# Altium schematic sheet MCU_System.SchDoc: MCU Power & Clocks
size A4; DocumentNumber: 4; SheetNumber: 4; SheetTotal: 8
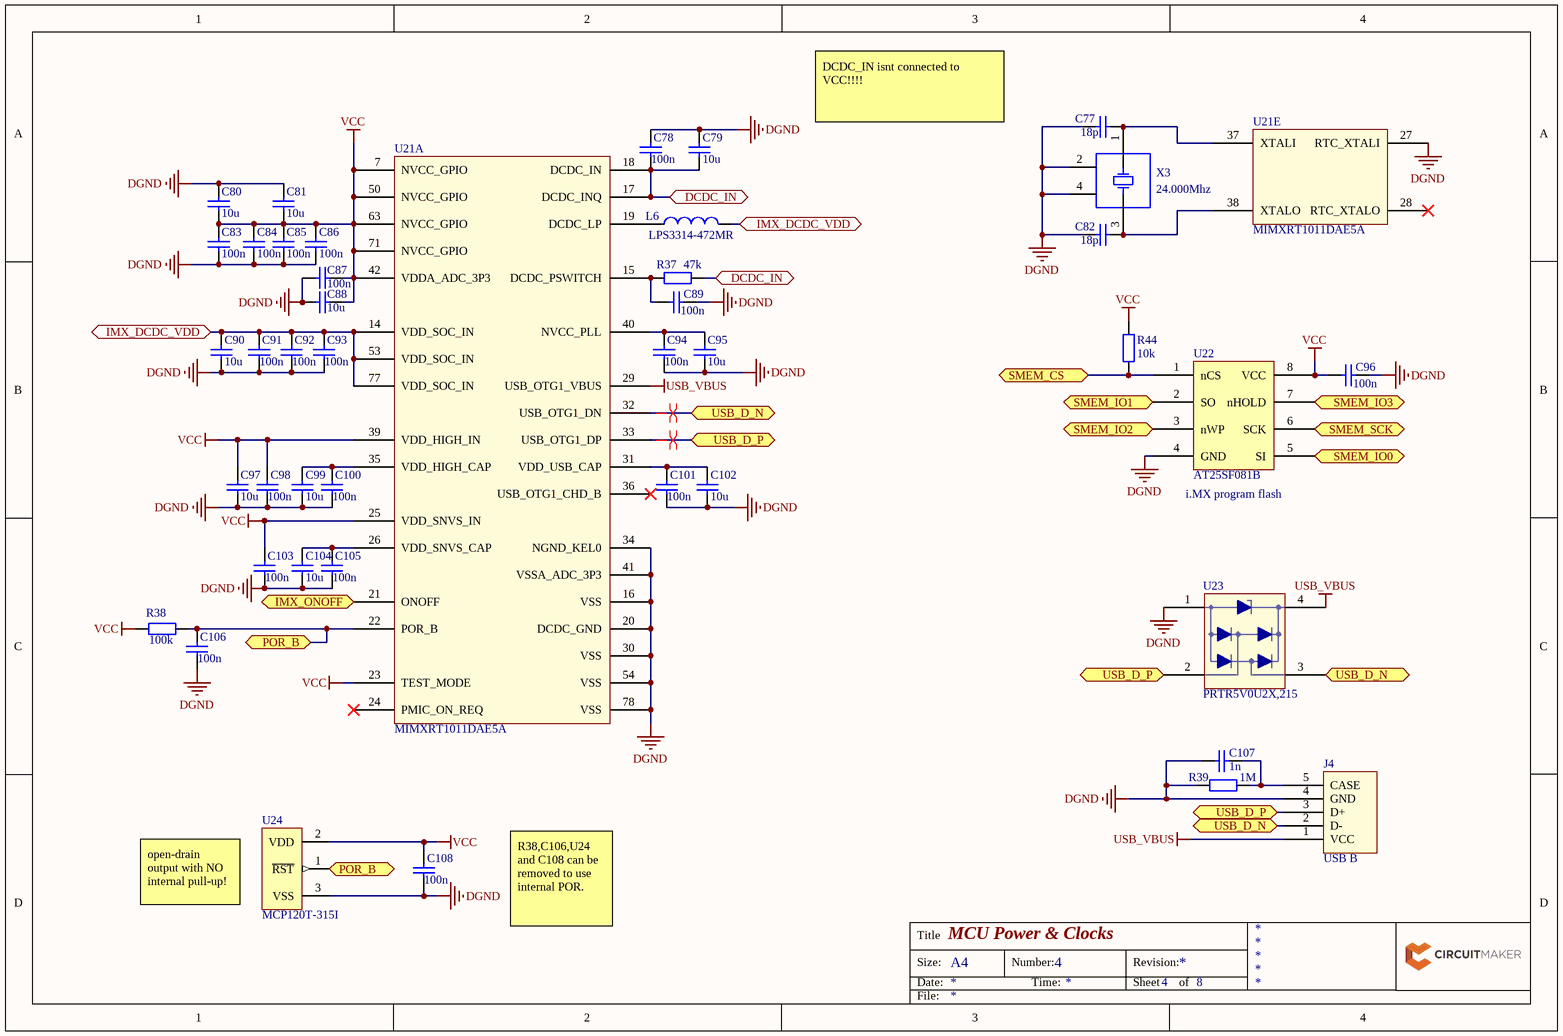
[diagram p0: MCU_System.SchDoc]

## Parts
C77  18p  [PCB-rf0pzaa82dpbeu9l4sxm-1]
C78  100n  [PCB-rf0pzaa82dpbeu9l4sxm-1]
C79  10u  [PCB-rf0pzaa82dpbeu9l4sxm-1]
C80  10u  [PCB-rf0pzaa82dpbeu9l4sxm-1]
C81  10u  [PCB-rf0pzaa82dpbeu9l4sxm-1]
C82  18p  [PCB-rf0pzaa82dpbeu9l4sxm-1]
C83  100n  [PCB-rf0pzaa82dpbeu9l4sxm-1]
C84  100n  [PCB-rf0pzaa82dpbeu9l4sxm-1]
C85  100n  [PCB-rf0pzaa82dpbeu9l4sxm-1]
C86  100n  [PCB-rf0pzaa82dpbeu9l4sxm-1]
C87  100n  [PCB-rf0pzaa82dpbeu9l4sxm-1]
C88  10u  [PCB-rf0pzaa82dpbeu9l4sxm-1]
C89  100n  [PCB-rf0pzaa82dpbeu9l4sxm-1]
C90  10u  [PCB-rf0pzaa82dpbeu9l4sxm-1]
C91  100n  [PCB-rf0pzaa82dpbeu9l4sxm-1]
C92  100n  [PCB-rf0pzaa82dpbeu9l4sxm-1]
C93  100n  [PCB-rf0pzaa82dpbeu9l4sxm-1]
C94  100n  [PCB-rf0pzaa82dpbeu9l4sxm-1]
C95  10u  [PCB-rf0pzaa82dpbeu9l4sxm-1]
C96  100n  [PCB-rf0pzaa82dpbeu9l4sxm-1]
C97  10u  [PCB-rf0pzaa82dpbeu9l4sxm-1]
C98  100n  [PCB-rf0pzaa82dpbeu9l4sxm-1]
C99  10u  [PCB-rf0pzaa82dpbeu9l4sxm-1]
C100  100n  [PCB-rf0pzaa82dpbeu9l4sxm-1]
C101  100n  [PCB-rf0pzaa82dpbeu9l4sxm-1]
C102  10u  [PCB-rf0pzaa82dpbeu9l4sxm-1]
C103  100n  [PCB-rf0pzaa82dpbeu9l4sxm-1]
C104  10u  [PCB-rf0pzaa82dpbeu9l4sxm-1]
C105  100n  [PCB-rf0pzaa82dpbeu9l4sxm-1]
C106  100n  [PCB-rf0pzaa82dpbeu9l4sxm-1]
C107  1n  [PCB-rf0pzaa82dpbeu9l4sxm-1]
C108  100n  [PCB-rf0pzaa82dpbeu9l4sxm-1]
J4  USB B  [PCB-zpxmgbfbf2leld1qryc0-1]
L6  LPS3314-472MR  [PCB-ugv71n5f75k2fx4txc2r-1]
R37  47k  [PCB-3d5y3t7f8drf35yjcj59-1]
R38  100k  [PCB-3d5y3t7f8drf35yjcj59-1]
R39  1M  [PCB-3d5y3t7f8drf35yjcj59-1]
R44  10k  [PCB-3d5y3t7f8drf35yjcj59-1]
U21  MIMXRT1011DAE5A  [PCB-9tw520wec8sfx58i85wg-1]  (parts A,E of 5)
U22  AT25SF081B  [PCBComponent_1]
U23  PRTR5V0U2X,215  [SOT143-4L]
U24  MCP120T-315I  [SOT-23-TT3_N]
X3  24.000Mhz  [PCB-pzpexmpe4kdarfiuuki7-1]

## Ports
DCDC_IN, IMX_DCDC_VDD, IMX_ONOFF (in), POR_B, SMEM_CS, SMEM_IO0, SMEM_IO1, SMEM_IO2, SMEM_IO3, SMEM_SCK, USB_D_N (bidir), USB_D_P (bidir)

## Nets
DGND: C77.2 C78.1 C79.2 C80.2 C81.2 C82.2 C83.1 C84.1 C85.1 C86.1 C87.2 C88.2 C89.2 C90.1 C91.2 C92.2 C93.2 C94.2 C95.1 C96.2 C97.1 C98.2 C99.1 C100.2 C101.2 C102.1 C103.2 C104.1 C105.2 C106.2 C107.1 C108.2 J4.4(GND) R39.1 U21.16(VSS) U21.20(DCDC_GND) U21.27(RTC_XTALI) U21.30(VSS) U21.34(NGND_KEL0) U21.41(VSSA_ADC_3P3) U21.54(VSS) U21.78(VSS) U22.4(GND) U23.1(GND) U24.3(VSS) X3.2 X3.4
USB_VBUS: J4.1(VCC) U21.29(USB_OTG1_VBUS) U23.4(VCC)
VCC: C80.1 C81.1 C83.2 C84.2 C85.2 C86.2 C87.1 C88.1 C96.1 C97.2 C98.1 C103.1 C108.1 R38.1 R44.2 U21.7(NVCC_GPIO) U21.23(TEST_MODE) U21.25(VDD_SNVS_IN) U21.39(VDD_HIGH_IN) U21.42(VDDA_ADC_3P3) U21.50(NVCC_GPIO) U21.63(NVCC_GPIO) U21.71(NVCC_GPIO) U22.8(VCC) U24.2(VDD)
DCDC_IN: C78.2 C79.1 R37.2 U21.17(DCDC_INQ) U21.18(DCDC_IN) ; port DCDC_IN
IMX_DCDC_VDD: C90.2 C91.1 C92.1 C93.1 L6.2 U21.14(VDD_SOC_IN) U21.53(VDD_SOC_IN) U21.77(VDD_SOC_IN) ; port IMX_DCDC_VDD
IMX_ONOFF: U21.21(ONOFF) ; port IMX_ONOFF
POR_B: C106.1 R38.2 U21.22(POR_B) U24.1(~{RST}) ; port POR_B
SMEM_CS: R44.1 U22.1(nCS) ; port SMEM_CS
SMEM_IO0: U22.5(SI) ; port SMEM_IO0
SMEM_IO1: U22.2(SO) ; port SMEM_IO1
SMEM_IO2: U22.3(nWP) ; port SMEM_IO2
SMEM_IO3: U22.7(nHOLD) ; port SMEM_IO3
SMEM_SCK: U22.6(SCK) ; port SMEM_SCK
USB_D_N: J4.2(D-) U21.32(USB_OTG1_DN) U23.3(I/O2) ; port USB_D_N
USB_D_P: J4.3(D+) U21.33(USB_OTG1_DP) U23.2(I/O1) ; port USB_D_P
NetC77_1: C77.1 U21.37(XTALI) X3.1
NetC82_1: C82.1 U21.38(XTALO) X3.3
NetC89_1: C89.1 R37.1 U21.15(DCDC_PSWITCH)
NetC94_1: C94.1 C95.2 U21.40(NVCC_PLL)
NetC99_2: C99.2 C100.1 U21.35(VDD_HIGH_CAP)
NetC101_1: C101.1 C102.2 U21.31(VDD_USB_CAP)
NetC104_2: C104.2 C105.1 U21.26(VDD_SNVS_CAP)
NetC107_2: C107.2 J4.5(CASE) R39.2
NetL6_1: L6.1 U21.19(DCDC_LP)

Not connected (* = marked no-connect by the designer): U21 24(PMIC_ON_REQ)* 28(RTC_XTALO)* 36(USB_OTG1_CHD_B)*

## Layout directives
differential pair: USB_D_N, USB_D_P

## Notes on the sheet
- DCDC_IN isnt connected to VCC!!!!
- (near U22) i.MX program flash
- open-drain output with NO internal pull-up!
- R38,C106,U24 and C108 can be removed to use internal POR.
- Title
- Size:
- Date:
- A4
- Number:
- Time:
- Revision:
- Sheet
- of
- File:

## Library data of the parts
C77-C108 = CMP-x8hddryxw4o380xfi98v-3: Generic Capacitor 0603; CustomComponentID: x8hddryxw4o380xfi98v
  C77 C82: LCSC Part #: C1679
  C78 C83-C87 C89 C91-C94 C96 C98 C100 C101 C103 C105 C106 C108: LCSC Part #: C14663; LCSC Part #: C109474
  C79-C81 C88 C90 C95 C97 C99 C102 C104: LCSC Part #: C19702; LCSC Part #: C25804
J4 = CMP-fd69346713c422ae-3: Conn.; Data; USB; Recept.; Shielded; Type B; Rt. Angle; w/Kinked Solder Tabs; White
L6 = CMP-54009cc0c0b08bc7-3: Power inductor, shielded, 20% tol, SMT, RoHS, lead-free; Manufacturer Part Number: LPS3314-824MRB; Inductance: 820 µH; Lead-Free Status: Contains Lead; RoHS: Compliant; Mounting Style: Surface Mount; REACH SVHC Compliance: No SVHC; Lifecycle Status: Active; OctopartID: 54009cc0c0b08bc7; Octopart URL: http://octopart.com/lps3314-824mrb-coilcraft-30061014
R37-R39 R44 = CMP-xcu3s4ikiffkkgbeyow5-1: Resistor 0603; CustomComponentID: xcu3s4ikiffkkgbeyow5
  R37: LCSC Part #: C25819
  R38: LCSC Part #: C25803
  R39: LCSC Part #: C22935
  R44: LCSC Part #: C25804; LCSC Part #: C19702; LCSC Part #: C21190; LCSC Part #: C81598; LCSC Part #: C1546; LCSC Part #: C23265; LCSC Part #: C23345
U21 = MIMXRT1011DAE5A: i.MX RT1011: 3.3 V 500 MHz 1 Core SMT 32-Bit Microprocessor IC - LQFP-80; OctopartID: 6e97a1b3b0b6b150; Manufacturer Part Number: MIMXRT1011DAE5A; Lifecycle Status: Not Listed by Manufacturer
U22 = CMP-7717bccd277da8d0-2: AT25SF161 Series 16 Mb (2 M x 8) 3.6 V SMT SPI Serial Flash Memory - SOIC-8; Manufacturer Part Number: AT25SF161-SSHD-T; Memory Size: 2000000 B; Lead-Free Status: Lead Free; Clock Speed: 104 MHz; Operating Temperature: -40.0 °C (min); Mounting Style: Surface Mount; RoHS: Compliant; OctopartID: 7717bccd277da8d0; Octopart URL: https://octopart.com/at25sf161-sshd-t-adesto+technologies-47215884
U23 = CMP-282990-4: PRTR5V0U2X - Ultra low capacitance double rail-to-rail ESD protection diode; Lifecycle Status: Active
U24 = CMP-981014-2: Microcontroller Supervisory Circuit with Push-Pull Output, 3-Pin SOT-23, Industrial Temperature, Tape and Reel; Manufacturer Part Number: MCP100T-315I/TT; Lead-Free Status: Lead Free; Quiescent Current: 4.5e-05 A; Threshold Voltage: 3.075 V; Case/Package: SOT-23; Lifecycle Status: Active; Mounting Style: Surface Mount; Number of Pins: 3; Octopart Url: https://octopart.com/mcp100t-315i%2Ftt-microchip-509982; OctopartID: f7583e551a20289f; REACH SVHC Compliance: No SVHC; RoHS: Compliant; Supply Current: 4.5e-05 A
X3 = CMP-096fc17935b7d6a8-2: Ember Chipset Crystal 565-2400-000, 24.000Mhz, 18Pf, 10Ppm@25C, 25Ppm-40+85C 3.2 X 2.5 X 0.70Mm / Tape & Reel; Load Capacitance: 18.0 pF; Packaging: Tape & Reel (TR)